# EAGLE design GPS-module (EAGLE 6.3)
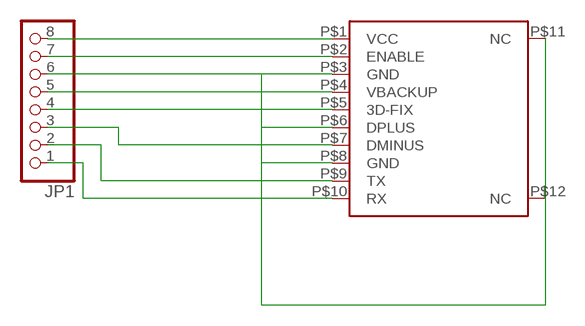
[diagram p0: schematic, sheet 1]

## Parts
JP1  PINHD-1X8BIG  [1X08-BIG]
U1  GPS_FGPMMOPA6B  [FGPMMOPA6B]

## Nets
ENABLE: JP1.7 U1.P$2(ENABLE)
EX_ANT: JP1.3 U1.P$7(DMINUS)
GND: JP1.6 U1.P$3(GND) U1.P$6(DPLUS) U1.P$8(GND) U1.P$11(NC) U1.P$12(NC)
N$5: JP1.4 U1.P$5(3D-FIX)
RX: JP1.1 U1.P$10(RX)
TX: JP1.2 U1.P$9(TX)
VBACKUP: JP1.5 U1.P$4(VBACKUP)
VCC: JP1.8 U1.P$1(VCC)

## Library data of the parts
JP1 = adafruit:PINHD-1X8: PIN HEADER
U1 = adafruit:GPS_FGPMMOPA6B: FGPMMOPA6B 16x16x0.6mm GPS Module NMEA Sentences: GGA, GSA, GSV, RMC, VTG General Specifications Chipset: MTK MT3329 Baud Rate: 9600bps (default) Update Rate: 1Hz (default) Cold Start: ~35s Operating Temp: -40 to 85°C DC Characteristics Supply Voltage: 3.2-5.0V Backup Battery Voltage: 2.0-4.3V Digital Logic (UART): 3.3V I(Tracking): 42mA I(Acquisition): 53mA I(BackupBattery): 10uA

## Board
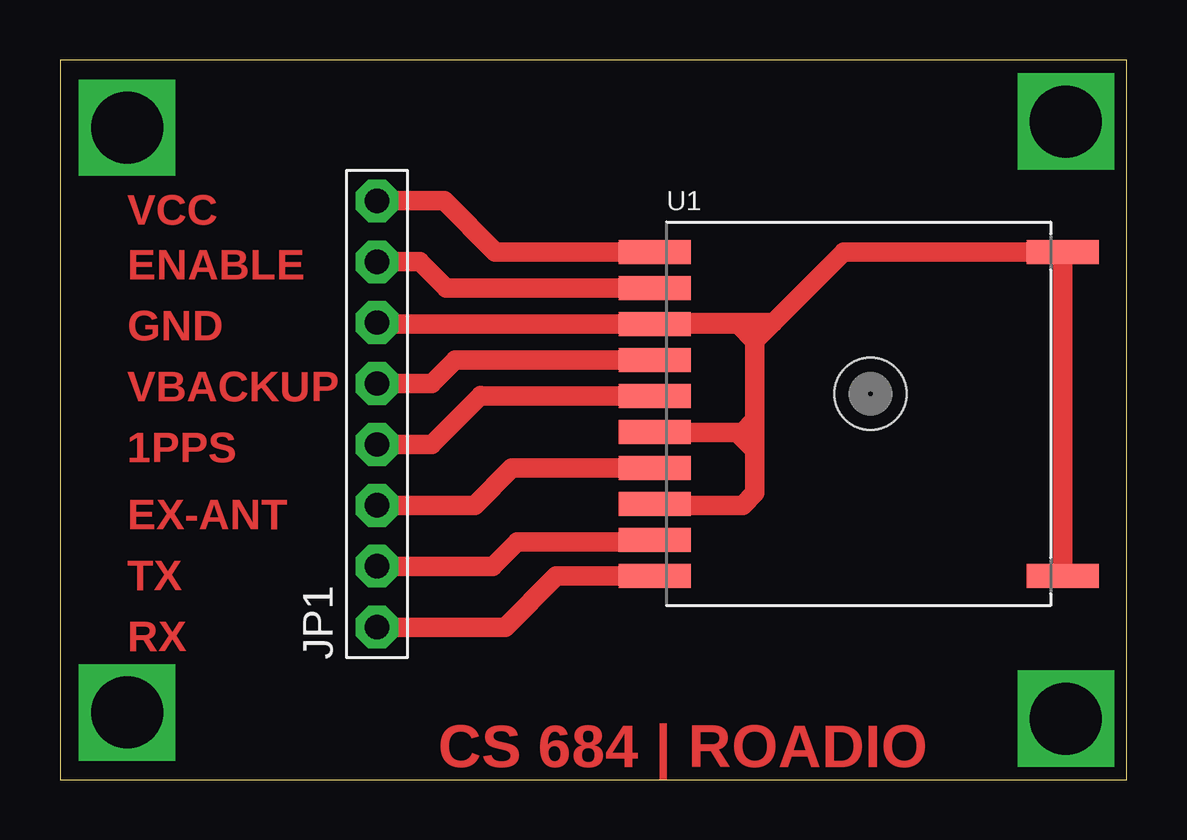
[diagram p1: board, top side]

Size 44.45 x 30 mm. Coordinates in mm from the lower left corner, seen from the top.
Outline: 0,0 44.45,0 44.45,30 0,30 0,0
Copper layers (1*16): Top 0.035mm / dielectric 1.5mm / Bottom 0.035mm
Design rules "default": minimum track width 10mil, minimum drill 24mil, track to track 8mil, track to pad 8mil, pad to pad 8mil, via to via 8mil, smd to smd 8mil, copper to edge 40mil, drill to drill 8mil, minimum pad ring 10mil, minimum via ring 8mil, stop-mask expansion 4mil, vias tented up to drill 0mil, thermal gap 10mil

### Footprints (pad centres in the part's own frame; a part is rotated, then mirrored left to right if it is on the bottom)
1X08-BIG = drill 1.016 pad 1.778 octagon: 1 -8.89,0; 2 -6.35,0; 3 -3.81,0; 4 -1.27,0; 5 1.27,0; 6 3.81,0; 7 6.35,0; 8 8.89,0
FGPMMOPA6B = smd 3 x 1: P$1 -8.5,6.75; P$2 -8.5,5.25; P$3 -8.5,3.75; P$4 -8.5,2.25; P$5 -8.5,0.75; P$6 -8.5,-0.75; P$7 -8.5,-2.25; P$8 -8.5,-3.75; P$9 -8.5,-5.25; P$10 -8.5,-6.75; P$11 8.5,6.75; P$12 8.5,-6.75 | hole 3: 0.5,0.85

### Placement (x,y rotation side)
JP1  13.21,15.24 90 top
U1  33.27,15.24 0 top

### Tracks (layer width: path | path; a pad name or v marks a point on that pad's centre or on a via)
ENABLE
  Top 0.813: U1.P$2 16.09,20.49 14.99,21.59 JP1.7
EX_ANT
  Top 0.813: U1.P$7 18.83,12.99 17.27,11.43 JP1.3
GND
  Top 0.813: JP1.6 13.27,18.99 U1.P$3 28.25,18.99 28.96,18.29 | 28.96,18.29 28.96,14.99 | 28.96,14.99 28.45,14.48 28.19,14.48 | U1.P$6 24.79,14.48 28.19,14.48 | 29.72,19.05 32.66,21.99 U1.P$11 U1.P$12 | 29.72,19.05 28.96,18.29 | 26.42,19.05 29.72,19.05 | 28.19,14.48 28.96,13.72 | 28.96,13.72 28.96,11.94 28.45,11.43 24.83,11.43 U1.P$8 | 28.96,14.99 28.96,13.72
N$1  (via drill 3 pad 4)
  other vias: 2.79,2.79 2.79,27.18 41.91,27.43 41.91,2.54
N$5
  Top 0.813: JP1.4 15.49,13.97 17.53,16 17.54,15.99 U1.P$5
RX
  Top 0.813: U1.P$10 20.68,8.49 18.54,6.35 JP1.1
TX
  Top 0.813: JP1.2 18.03,8.89 19.05,9.91 24.69,9.91 U1.P$9
VBACKUP
  Top 0.813: U1.P$4 16.47,17.49 15.49,16.51 JP1.5
VCC
  Top 0.813: U1.P$1 18.14,21.99 16,24.13 JP1.8

### Text on the board
Top: VCC | ENABLE | GND | VBACKUP | 1PPS | EX-ANT | TX | RX | CS 684 | ROADIO